# Altium schematic sheet three-phase_inverter.SchDoc: Circuito Inversor Trifásico
size A4; Engineer: Amós Nunes; Organization: occhi; SheetNumber: 4; SheetTotal: 5; Tamanho: A4; Equipament: E. T. Wheelchair
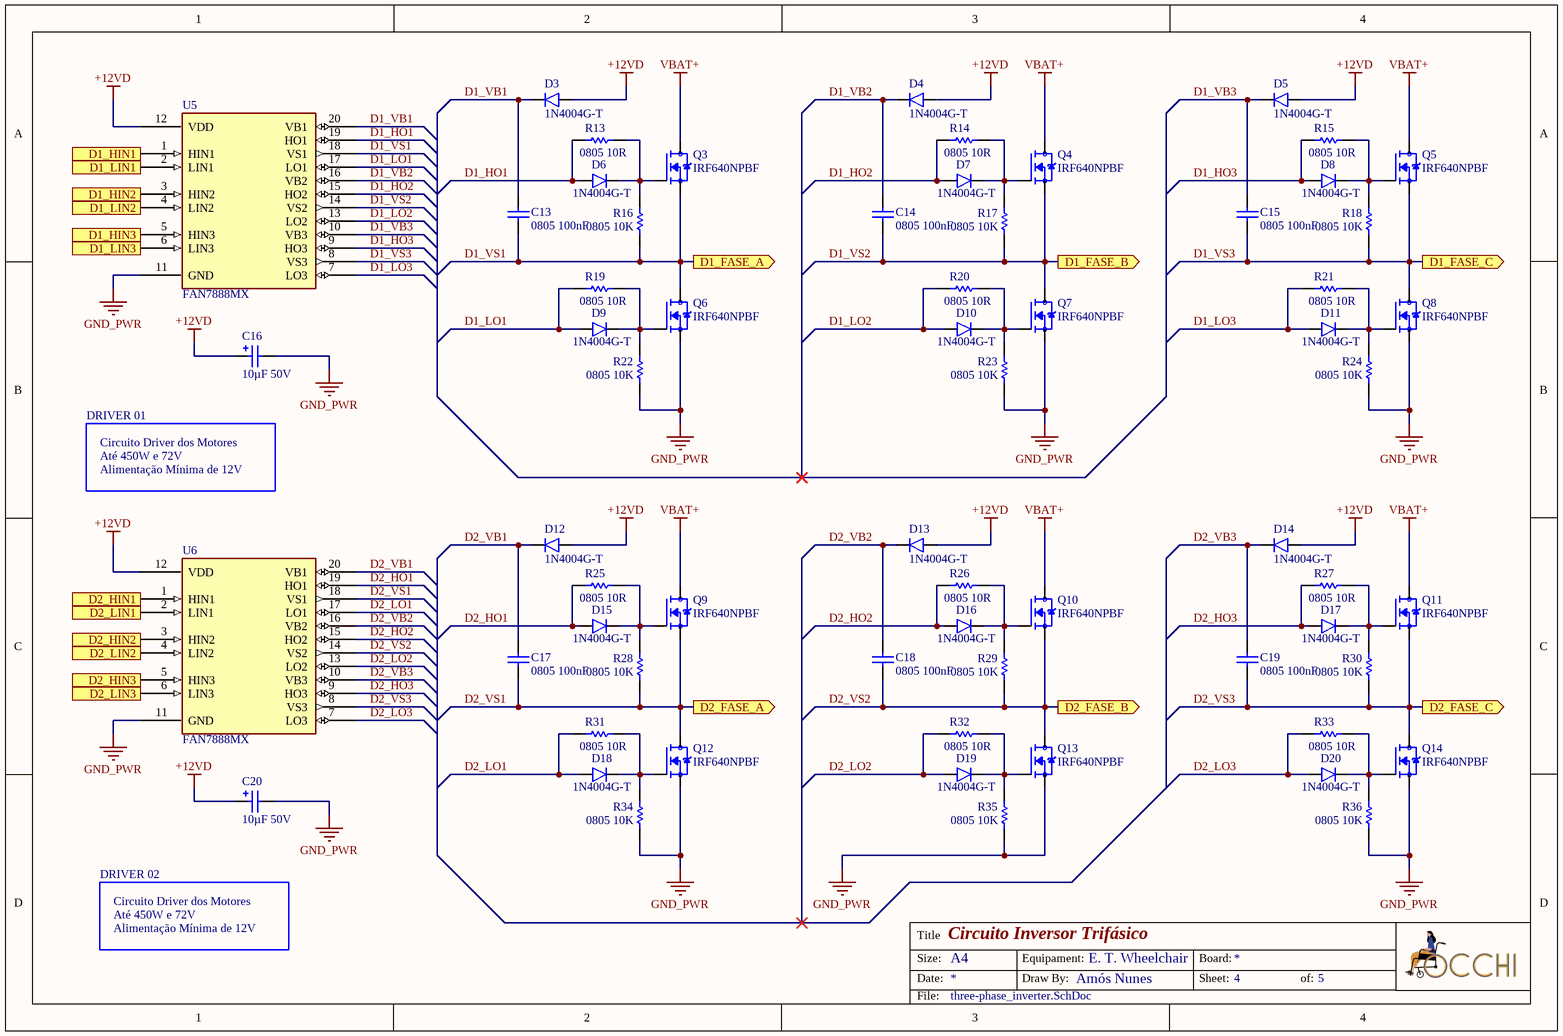
[diagram p0: three-phase_inverter.SchDoc]

## Parts
C13  0805 100nF  [CAP0805]
C14  0805 100nF  [CAP0805]
C15  0805 100nF  [CAP0805]
C16  10µF 50V  [CAP_PK/PZ_6P3X11_LOW_RUB]
C17  0805 100nF  [CAP0805]
C18  0805 100nF  [CAP0805]
C19  0805 100nF  [CAP0805]
C20  10µF 50V  [CAP_PK/PZ_6P3X11_LOW_RUB]
D3  1N4004G-T  [DO41-10]
D4  1N4004G-T  [DO41-10]
D5  1N4004G-T  [DO41-10]
D6  1N4004G-T  [DO41-10]
D7  1N4004G-T  [DO41-10]
D8  1N4004G-T  [DO41-10]
D9  1N4004G-T  [DO41-10]
D10  1N4004G-T  [DO41-10]
D11  1N4004G-T  [DO41-10]
D12  1N4004G-T  [DO41-10]
D13  1N4004G-T  [DO41-10]
D14  1N4004G-T  [DO41-10]
D15  1N4004G-T  [DO41-10]
D16  1N4004G-T  [DO41-10]
D17  1N4004G-T  [DO41-10]
D18  1N4004G-T  [DO41-10]
D19  1N4004G-T  [DO41-10]
D20  1N4004G-T  [DO41-10]
Q3  IRF640NPBF  [TO220AB_VIS]
Q4  IRF640NPBF  [TO220AB_VIS]
Q5  IRF640NPBF  [TO220AB_VIS]
Q6  IRF640NPBF  [TO220AB_VIS]
Q7  IRF640NPBF  [TO220AB_VIS]
Q8  IRF640NPBF  [TO220AB_VIS]
Q9  IRF640NPBF  [TO220AB_VIS]
Q10  IRF640NPBF  [TO220AB_VIS]
Q11  IRF640NPBF  [TO220AB_VIS]
Q12  IRF640NPBF  [TO220AB_VIS]
Q13  IRF640NPBF  [TO220AB_VIS]
Q14  IRF640NPBF  [TO220AB_VIS]
R13  0805 10R  [CAP0805]
R14  0805 10R  [CAP0805]
R15  0805 10R  [CAP0805]
R16  0805 10K  [RES0805]
R17  0805 10K  [RES0805]
R18  0805 10K  [RES0805]
R19  0805 10R  [CAP0805]
R20  0805 10R  [CAP0805]
R21  0805 10R  [CAP0805]
R22  0805 10K  [RES0805]
R23  0805 10K  [RES0805]
R24  0805 10K  [RES0805]
R25  0805 10R  [CAP0805]
R26  0805 10R  [CAP0805]
R27  0805 10R  [CAP0805]
R28  0805 10K  [RES0805]
R29  0805 10K  [RES0805]
R30  0805 10K  [RES0805]
R31  0805 10R  [CAP0805]
R32  0805 10R  [CAP0805]
R33  0805 10R  [CAP0805]
R34  0805 10K  [RES0805]
R35  0805 10K  [RES0805]
R36  0805 10K  [RES0805]
U5  FAN7888MX  [SOIC20_13X7P6_ONS]
U6  FAN7888MX  [SOIC20_13X7P6_ONS]

## Ports
D1_FASE_A (out), D1_FASE_B (out), D1_FASE_C (out), D1_HIN1 (in), D1_HIN2 (in), D1_HIN3 (in), D1_LIN1 (in), D1_LIN2 (in), D1_LIN3 (in), D2_FASE_A (out), D2_FASE_B (out), D2_FASE_C (out), D2_HIN1 (in), D2_HIN2 (in), D2_HIN3 (in), D2_LIN1 (in), D2_LIN2 (in), D2_LIN3 (in)

## Nets
+12VD: C16.1 C20.1 D3.2(A) D4.2(A) D5.2(A) D12.2(A) D13.2(A) D14.2(A) U5.12(VDD) U6.12(VDD)
GND_PWR: C16.2 C20.2 Q6.3(S) Q7.3(S) Q8.3(S) Q12.3(S) Q13.3(S) Q14.3(S) R22.2 R23.2 R24.2 R34.2 R35.2 R36.2 U5.11(GND) U6.11(GND)
VBAT+: Q3.2(D) Q4.2(D) Q5.2(D) Q9.2(D) Q10.2(D) Q11.2(D)
D1_HIN1: U5.1(HIN1) ; port D1_HIN1
D1_HIN2: U5.3(HIN2) ; port D1_HIN2
D1_HIN3: U5.5(HIN3) ; port D1_HIN3
D1_HO1: D6.2(A) R13.1 U5.19(HO1)
D1_HO2: D7.2(A) R14.1 U5.15(HO2)
D1_HO3: D8.2(A) R15.1 U5.9(HO3)
D1_LIN1: U5.2(LIN1) ; port D1_LIN1
D1_LIN2: U5.4(LIN2) ; port D1_LIN2
D1_LIN3: U5.6(LIN3) ; port D1_LIN3
D1_LO1: D9.2(A) R19.1 U5.17(LO1)
D1_LO2: D10.2(A) R20.1 U5.13(LO2)
D1_LO3: D11.2(A) R21.1 U5.7(LO3)
D1_VB1: C13.1 D3.1(K) U5.20(VB1)
D1_VB2: C14.1 D4.1(K) U5.16(VB2)
D1_VB3: C15.1 D5.1(K) U5.10(VB3)
D1_VS1: C13.2 Q3.3(S) Q6.2(D) R16.2 U5.18(VS1) ; port D1_FASE_A
D1_VS2: C14.2 Q4.3(S) Q7.2(D) R17.2 U5.14(VS2) ; port D1_FASE_B
D1_VS3: C15.2 Q5.3(S) Q8.2(D) R18.2 U5.8(VS3) ; port D1_FASE_C
D2_HIN1: U6.1(HIN1) ; port D2_HIN1
D2_HIN2: U6.3(HIN2) ; port D2_HIN2
D2_HIN3: U6.5(HIN3) ; port D2_HIN3
D2_HO1: D15.2(A) R25.1 U6.19(HO1)
D2_HO2: D16.2(A) R26.1 U6.15(HO2)
D2_HO3: D17.2(A) R27.1 U6.9(HO3)
D2_LIN1: U6.2(LIN1) ; port D2_LIN1
D2_LIN2: U6.4(LIN2) ; port D2_LIN2
D2_LIN3: U6.6(LIN3) ; port D2_LIN3
D2_LO1: D18.2(A) R31.1 U6.17(LO1)
D2_LO2: D19.2(A) R32.1 U6.13(LO2)
D2_LO3: D20.2(A) R33.1 U6.7(LO3)
D2_VB1: C17.1 D12.1(K) U6.20(VB1)
D2_VB2: C18.1 D13.1(K) U6.16(VB2)
D2_VB3: C19.1 D14.1(K) U6.10(VB3)
D2_VS1: C17.2 Q9.3(S) Q12.2(D) R28.2 U6.18(VS1) ; port D2_FASE_A
D2_VS2: C18.2 Q10.3(S) Q13.2(D) R29.2 U6.14(VS2) ; port D2_FASE_B
D2_VS3: C19.2 Q11.3(S) Q14.2(D) R30.2 U6.8(VS3) ; port D2_FASE_C
NetD6_1: D6.1(K) Q3.1(G) R13.2 R16.1
NetD7_1: D7.1(K) Q4.1(G) R14.2 R17.1
NetD8_1: D8.1(K) Q5.1(G) R15.2 R18.1
NetD9_1: D9.1(K) Q6.1(G) R19.2 R22.1
NetD10_1: D10.1(K) Q7.1(G) R20.2 R23.1
NetD11_1: D11.1(K) Q8.1(G) R21.2 R24.1
NetD15_1: D15.1(K) Q9.1(G) R25.2 R28.1
NetD16_1: D16.1(K) Q10.1(G) R26.2 R29.1
NetD17_1: D17.1(K) Q11.1(G) R27.2 R30.1
NetD18_1: D18.1(K) Q12.1(G) R31.2 R34.1
NetD19_1: D19.1(K) Q13.1(G) R32.2 R35.1
NetD20_1: D20.1(K) Q14.1(G) R33.2 R36.1

## Notes on the sheet
- DRIVER 01
- Circuito Driver dos Motores
- Até 450W e 72V
- Alimentação Mínima de 12V
- DRIVER 02
- Title
- Size:
- Date:
- Equipament:
- Draw By:
- Sheet:
- Board:
- of:
- File:

## Library data of the parts
C13-C15 C17-C19 = CC0805KRX7R9BB104: CC Series 0805 0.1 uF 50 V ±10 % Tolerance X7R SMT Multilayer Ceramic Capacitor; Manufacturer: Yageo; Tolerance: 10%; Voltage Rating: 50V; Insulation Resistance: 100GR; Supplier 1: Digi-Key; Manufacturer Part Number: CC0805KRX7R9BB104; RoHS: Yes; Category: Ceramic Capacitors; Stock 1: 7319595; Pricing 1: 4000=0,01864, 8000=0,01734 (USD); Mount: Surface Mount; Case/Package: 0805; Number of Pins: 2; Case Code (Metric): 2012; Case Code (Imperial): 0805; Material: Ceramic; Min Operating Temperature: -55°C; Max Operating Temperature: 125°C; Capacitance: 100nF; Dielectric: X7R; Packaging: Tape and Reel; Package Quantity: 1; Termination: SMD/SMT; Voltage: 50V; Series: CC; Length: 2mm; Width: 0.049inch; Height: 0.85mm; Depth: 1.25mm; Thickness: 0.033inch; Radiation Hardening: No; REACH SVHC: No SVHC; Lead Free: Lead Free; Halogen Free: Halogen Free; RoHS Compliant: Yes; ComponentLink1URL: https://datasheet.ciiva.com/11786/0900766b80d84f1d-11786009.pdf?src-supplier=RSComponents; ComponentLink1Description: https://datasheet.ciiva.com/11786/0900766b80d84f1d-11786009.pdf?src-supplier=RSComponents; ComponentLink2URL: https://datasheet.ciiva.com/155/mlccorderingcode-155929.pdf?src-supplier=Digi-Key; ComponentLink2Description: https://datasheet.ciiva.com/155/mlccorderingcode-155929.pdf?src-supplier=Digi-Key; ComponentLink3URL: https://datasheet.ciiva.com/155/mlccorderingcode-155930.pdf?src-supplier=Digi-Key; ComponentLink3Description: https://datasheet.ciiva.com/155/mlccorderingcode-155930.pdf?src-supplier=Digi-Key; ComponentLink4URL: https://datasheet.ciiva.com/155/mlccorderingcode-155931.pdf?src-supplier=Digi-Key; ComponentLink4Description: https://datasheet.ciiva.com/155/mlccorderingcode-155931.pdf?src-supplier=Digi-Key; ComponentLink5URL: https://datasheet.ciiva.com/11464/upy-gphc-x7r-6-3v-to-50v-8-11464757.pdf?src-supplier=Avnet; ComponentLink5Description: https://datasheet.ciiva.com/11464/upy-gphc-x7r-6-3v-to-50v-8-11464757.pdf?src-supplier=Avnet; ComponentLink6URL: https://datasheet.ciiva.com/16625/upy-gphc-x7r-6-3v-to-50v-8-16625549.pdf?src-supplier=Avnet+Europe; ComponentLink6Description: https://datasheet.ciiva.com/16625/upy-gphc-x7r-6-3v-to-50v-8-16625549.pdf?src-supplier=Avnet+Europe; ComponentLink7URL: https://datasheet.ciiva.com/28450/1489800-28450805.pdf?src-supplier=Element14; ComponentLink7Description: https://datasheet.ciiva.com/28450/1489800-28450805.pdf?src-supplier=Element14; ComponentLink8URL: https://datasheet.ciiva.com/46393/1734573-46393307.pdf?src-supplier=Element14; ComponentLink8Description: https://datasheet.ciiva.com/46393/1734573-46393307.pdf?src-supplier=Element14; ComponentLink9URL: https://datasheet.ciiva.com/29242/445210-da-01-en-kerko-chip-0805-x7r-0-1uf-10proz-50vg-29242074.pdf?src-supplier=Conrad; ComponentLink9Description: https://datasheet.ciiva.com/29242/445210-da-01-en-kerko-chip-0805-x7r-0-1uf-10proz-50vg-29242074.pdf?src-supplier=Conrad; Supplier Part Number 1: 311-1140-2-ND
C16 C20 = 50YXF10MEFC5X11: 10uF ±20% 50V 5000hrs@105°C AEC_D5x11mm_2mm_TM; Mfr_Name: Rubycon; Manufacturer_Part_Number: 16PK330MEFC6.3X11; Type: DEV; Capacitance: 330uF; Ripple Current: 360mA; Voltage Rating: 16V; Life (Hours): 2000Hour; Leakage Current: 3uA; Lead Diameter: 0.5mm; Dielectric Material: Aluminium; Impedance: 1.5R; Copyright: Copyright (C) 2021 Ultra Librarian. All rights reserved.; Digi-Key_Part_Number_1: 1189-1122-ND; RefDes: RefDes; Manufacturer: Rubycon; Manufacturer Part Number: 16PK330MEFC6.3X11; RoHS: Yes; Category: Aluminum Electrolytic Capacitors; Stock 1: 1848; Pricing 1: 1=0,04600, 10=0,04600, 25=0,04600, 50=0,04600, 100=0,04600, 500=0,04600 (USD); Mount: Through Hole; Case/Package: Radial; Number of Pins: 2; Min Operating Temperature: -40°C; Max Operating Temperature: 85°C; Tolerance: 20%; Termination: Radial; Ripple Current (AC): 360mA; Package Quantity: 2000; Packaging: Bulk; Voltage: 16V; Voltage Rating (DC): 16V; Series: PK; Construction: RADIAL; Diameter: 6.3mm; Height: 11mm; Lead Pitch: 2.5mm; Height - Seated (Max): 0.492inch; Radiation Hardening: No; REACH SVHC: No SVHC; RoHS Compliant: Yes; ComponentLink1URL: https://datasheet.ciiva.com/25614/0900766b810f8819-25614366.pdf?src-supplier=RSComponents; ComponentLink1Description: https://datasheet.ciiva.com/25614/0900766b810f8819-25614366.pdf?src-supplier=RSComponents; ComponentLink2URL: https://datasheet.ciiva.com/11690/e-pk-11690815.pdf?src-supplier=Avnet; ComponentLink2Description: https://datasheet.ciiva.com/11690/e-pk-11690815.pdf?src-supplier=Avnet; ComponentLink3URL: https://datasheet.ciiva.com/6328/e-pk-6328463.pdf?src-supplier=Digi-Key; ComponentLink3Description: https://datasheet.ciiva.com/6328/e-pk-6328463.pdf?src-supplier=Digi-Key; Stock 2: 46092; Pricing 2: 1=0,33800, 5=0,33800, 10=0,23000, 25=0,18400, 50=0,13800, 100=0,11600, 500=0,07900 (USD); ComponentLink4URL: https://datasheet.ciiva.com/7976/e-yxf-7976037.pdf?src-supplier=Element14; ComponentLink4Description: https://datasheet.ciiva.com/7976/e-yxf-7976037.pdf?src-supplier=Element14; ComponentLink5URL: https://datasheet.ciiva.com/6310/e-yxf-6310901.pdf?src-supplier=Digi-Key; ComponentLink5Description: https://datasheet.ciiva.com/6310/e-yxf-6310901.pdf?src-supplier=Digi-Key; Supplier 1: Newark; Supplier Part Number 1: 31M6644
D3-D20 = 1N4004G-T: Diode Standard Recovery Rectifier 400V 1A 2-Pin DO-41 T/R; Manufacturer: Diodes; Element Configuration: Single; Max Reverse Current: 5uA; Max Surge Current: 30A; Capacitance: 8pF; Forward Voltage: 1V; Recovery Time: 2us; Supplier 1: Arrow Electronics; Manufacturer Part Number: 1N4004G-T; RoHS: Yes; Category: Rectifier Diodes; Stock 1: 4700; Pricing 1: 1=0,27080, 10=0,22520, 25=0,22330, 100=0,12160, 250=0,12050, 500=0,08530, 1000=0,05810, 3000=0,05260 (USD); Mount: Through Hole; Case/Package: DO-41; Number of Pins: 2; Weight: 0.010582oz; Min Operating Temperature: -65°C; Max Operating Temperature: 175°C; Packaging: Tape and Reel; Package Quantity: 5000; Polarity: Standard; Voltage Rating (DC): 400V; Current Rating: 1A; Output Current: 1A; Max Repetitive Reverse Voltage (Vrrm): 400V; Peak Non-Repetitive Surge Current: 30A; Forward Current: 1A; Reverse Voltage (DC): 400V; Average Rectified Current: 1A; Reverse Recovery Time: 2us; Max Reverse Voltage (DC): 400V; Series: -; Length: 5.21mm; Width: 2.72mm; Height: 2.72mm; Radiation Hardening: No; Lead Free: Lead Free; RoHS Compliant: Yes; ComponentLink1URL: https://datasheet.ciiva.com/27052/1586381-27052621.pdf?src-supplier=Jameco; ComponentLink1Description: https://datasheet.ciiva.com/27052/1586381-27052621.pdf?src-supplier=Jameco; ComponentLink2URL: https://datasheet.ciiva.com/912/ds29002-912103.pdf?src-supplier=Digi-Key; ComponentLink2Description: https://datasheet.ciiva.com/912/ds29002-912103.pdf?src-supplier=Digi-Key; ComponentLink3URL: https://datasheet.ciiva.com/912/ds29002-912104.pdf?src-supplier=Digi-Key; ComponentLink3Description: https://datasheet.ciiva.com/912/ds29002-912104.pdf?src-supplier=Digi-Key; ComponentLink4URL: https://datasheet.ciiva.com/15219/getdatasheetpartid-233986-15219541.pdf?src-supplier=Verical; ComponentLink4Description: https://datasheet.ciiva.com/15219/getdatasheetpartid-233986-15219541.pdf?src-supplier=Verical; Supplier Part Number 1: 1N4004G-T
Q3-Q14 = IRF640NPBF: Mosfet, Power; N-ch; Vdss 200V; Rds(on) 0.15 Ohm; Id 18A; TO-220AB; Pd 150W; Vgs +/-20V; Manufacturer: International Rectifier; MF: Infineon; Input Capacitance: 1.16nF; Rds On Max: 150mR; Gate to Source Voltage (Vgs): 20V; Number of Elements: 1; Rise Time: 19ns; Turn-Off Delay Time: 23ns; Turn-On Delay Time: 10ns; Recovery Time: 241ns; Nominal Vgs: 4V; Fall Time: 5.5ns; Element Configuration: Single; Package: TO-220 Infineon; MP: IRF640NPBF; Price: None; Availability: Unavailable; Value: *; SnapEDA_Link: https://www.snapeda.com/parts/IRF640NPBF/Infineon%20Technologies/view-part/1737186/?ref=snap; Supplier 1: Newark; Manufacturer Part Number: IRF640NPBF; RoHS: Yes; Category: MOSFETs; Mount: Through Hole; Case/Package: TO-220AB; Number of Pins: 3; Min Operating Temperature: -55°C; Max Operating Temperature: 175°C; Max Power Dissipation: 150W; Packaging: Rail/Tube; Drain to Source Voltage (Vdss): 200V; Continuous Drain Current (ID): 18A; Power Dissipation: 150W; Package Quantity: 50; Drain to Source Breakdown Voltage: 200V; Drain to Source Resistance: 150mR; Dual Supply Voltage: 200V; Termination: Through Hole; Voltage Rating (DC): 200V; Current Rating: 18A; On-State Resistance: 150mR; Series: HEXFET®; Drain-source On Resistance-Max: 150mR; Length: 10.67mm; Width: 4.83mm; Height: 8.77mm; Radiation Hardening: No; RoHS Compliant: Yes; REACH SVHC: No SVHC; Lead Free: Lead Free; ComponentLink1URL: https://datasheet.ciiva.com/6377/irf640npbf-6377424.pdf?src-supplier=Digi-Key; ComponentLink1Description: https://datasheet.ciiva.com/6377/irf640npbf-6377424.pdf?src-supplier=Digi-Key; ComponentLink2URL: https://datasheet.ciiva.com/19459/1560288-19459517.pdf?src-supplier=Jameco; ComponentLink2Description: https://datasheet.ciiva.com/19459/1560288-19459517.pdf?src-supplier=Jameco; ComponentLink3URL: https://datasheet.ciiva.com/7798/irf640npbf-7798652.pdf?src-supplier=Element14; ComponentLink3Description: https://datasheet.ciiva.com/7798/irf640npbf-7798652.pdf?src-supplier=Element14; ComponentLink4URL: https://datasheet.ciiva.com/16449/irf640n-16449351.pdf?src-supplier=Future+Electronics; ComponentLink4Description: https://datasheet.ciiva.com/16449/irf640n-16449351.pdf?src-supplier=Future+Electronics; ComponentLink5URL: https://datasheet.ciiva.com/7253/irf640npbf-7253768.pdf?src-supplier=Newark; ComponentLink5Description: https://datasheet.ciiva.com/7253/irf640npbf-7253768.pdf?src-supplier=Newark; Supplier Part Number 1: 63J7351
R13-R15 R19-R21 R25-R27 R31-R33 = RC0805FR-0710RL: 10R Ohms ± 1.00% 0.125W ± 200ppm/℃ 0805; Manufacturer: Yageo; Power Rating: 125mW; Tolerance: 1%; Voltage Rating: 150V; Temperature Coefficient: 200ppm/°C; Supplier 1: RSComponents; Manufacturer Part Number: RC0805FR-0710RL; RoHS: Yes; Category: Chip SMD Resistors; Stock 1: 170000; Pricing 1: 5000=0,01300 (USD); Case/Package: 0805; Number of Pins: 2; Case Code (Imperial): 0805; Case Code (Metric): 2012; Size Code: 0805; Min Operating Temperature: -55°C; Max Operating Temperature: 155°C; Resistance: 10R; Packaging: Tape and Reel; Voltage Rating (DC): 150V; Package Quantity: 1; Termination: SMD/SMT; Resistor Type: Thick Film; Number of Terminations: 2; Max Power Dissipation: 125mW; Features: Moisture Resistant; Series: RC; Resistance Tolerance: 1%; Construction: Rectangular; Technology: THICK FILM; Length: 2mm; Width: 1.25mm; Height: 0.5mm; Depth: 1.25mm; RoHS Compliant: Yes; REACH SVHC: No SVHC; Lead Free: Lead Free; ComponentLink1URL: https://datasheet.ciiva.com/11809/0900766b8106beab-11809370.pdf?src-supplier=RSComponents; ComponentLink1Description: https://datasheet.ciiva.com/11809/0900766b8106beab-11809370.pdf?src-supplier=RSComponents; ComponentLink2URL: https://datasheet.ciiva.com/46412/444164-46412859.pdf?src-supplier=Element14; ComponentLink2Description: https://datasheet.ciiva.com/46412/444164-46412859.pdf?src-supplier=Element14; ComponentLink3URL: https://datasheet.ciiva.com/46447/444164-46447565.pdf?src-supplier=Element14; ComponentLink3Description: https://datasheet.ciiva.com/46447/444164-46447565.pdf?src-supplier=Element14; ComponentLink4URL: https://datasheet.ciiva.com/2457/pyu-r-int-thick-7-2457099.pdf?src-supplier=Digi-Key; ComponentLink4Description: https://datasheet.ciiva.com/2457/pyu-r-int-thick-7-2457099.pdf?src-supplier=Digi-Key; ComponentLink5URL: https://datasheet.ciiva.com/2457/pyu-r-int-thick-7-2457100.pdf?src-supplier=Digi-Key; ComponentLink5Description: https://datasheet.ciiva.com/2457/pyu-r-int-thick-7-2457100.pdf?src-supplier=Digi-Key; ComponentLink6URL: https://datasheet.ciiva.com/2457/pyu-r-int-thick-7-2457098.pdf?src-supplier=Digi-Key; ComponentLink6Description: https://datasheet.ciiva.com/2457/pyu-r-int-thick-7-2457098.pdf?src-supplier=Digi-Key; ComponentLink7URL: https://datasheet.ciiva.com/12555/rc0805-257173-12555112.pdf?src-supplier=Mouser; ComponentLink7Description: https://datasheet.ciiva.com/12555/rc0805-257173-12555112.pdf?src-supplier=Mouser; ComponentLink8URL: https://datasheet.ciiva.com/7941/444164-7941688.pdf?src-supplier=Element14; ComponentLink8Description: https://datasheet.ciiva.com/7941/444164-7941688.pdf?src-supplier=Element14; ComponentLink9URL: https://datasheet.ciiva.com/7941/444164-7941687.pdf?src-supplier=Element14; ComponentLink9Description: https://datasheet.ciiva.com/7941/444164-7941687.pdf?src-supplier=Element14; Supplier Part Number 1: 6185179
R16-R18 R22-R24 R28-R30 R34-R36 = RC0805FR-0710KL: 10K Omhs 0805 ± 1.00% 0.125W ± 100ppm/℃; Manufacturer: Yageo; Manufacturer Part Number: RC0603FR-0710KL; Tolerance: 1%; Resistance: 10kR; Temperature Coefficient: 100ppm/°C; Voltage Rating: 75V; Voltage Rating (DC): 50V; Power Rating: 100mW; RoHS: Yes; Category: Chip SMD Resistors; Stock 1: 19091268; Pricing 1: 5000=0,00312 (USD); Case/Package: 0603; Number of Pins: 2; Case Code (Imperial): 0603; Case Code (Metric): 1608; Weight: 7.1E-05oz; Size Code: 0603; Min Operating Temperature: -55°C; Max Operating Temperature: 155°C; Resistor Type: Thick Film; Packaging: Tape and Reel; Termination: SMD/SMT; Features: Moisture Resistant; Series: RC; Max Power Dissipation: 100mW; Number of Terminations: 2; Resistance Tolerance: 1%; Construction: Rectangular; Length: 1.6mm; Width: 0.8mm; Height: 0.45mm; Depth: 0.8mm; Lead Pitch: 0.3mm; RoHS Compliant: Yes; REACH SVHC: Unknown; Military Standard: Not; Lead Free: Lead Free; ComponentLink1URL: https://datasheet.ciiva.com/7660/38590-7660789.pdf?src-supplier=Element14; ComponentLink1Description: https://datasheet.ciiva.com/7660/38590-7660789.pdf?src-supplier=Element14; ComponentLink2URL: https://datasheet.ciiva.com/7983/443971-7983596.pdf?src-supplier=Element14; ComponentLink2Description: https://datasheet.ciiva.com/7983/443971-7983596.pdf?src-supplier=Element14; ComponentLink3URL: https://datasheet.ciiva.com/22747/443971-22747519.pdf?src-supplier=Element14; ComponentLink3Description: https://datasheet.ciiva.com/22747/443971-22747519.pdf?src-supplier=Element14; ComponentLink4URL: https://datasheet.ciiva.com/46440/1868787-46440891.pdf?src-supplier=Element14; ComponentLink4Description: https://datasheet.ciiva.com/46440/1868787-46440891.pdf?src-supplier=Element14; ComponentLink5URL: https://datasheet.ciiva.com/7746/1738695-7746239.pdf?src-supplier=Element14; ComponentLink5Description: https://datasheet.ciiva.com/7746/1738695-7746239.pdf?src-supplier=Element14; ComponentLink6URL: https://datasheet.ciiva.com/15189/getdatasheetpartid-409289-15189591.pdf?src-supplier=Verical; ComponentLink6Description: https://datasheet.ciiva.com/15189/getdatasheetpartid-409289-15189591.pdf?src-supplier=Verical; Stock 2: 435000; Pricing 2: 5000=0,00700 (USD); Package Quantity: 1; Technology: THICK FILM; ComponentLink7URL: https://datasheet.ciiva.com/11808/0900766b8106beab-11808151.pdf?src-supplier=RSComponents; ComponentLink7Description: https://datasheet.ciiva.com/11808/0900766b8106beab-11808151.pdf?src-supplier=RSComponents; ComponentLink8URL: https://datasheet.ciiva.com/46447/444164-46447563.pdf?src-supplier=Element14; ComponentLink8Description: https://datasheet.ciiva.com/46447/444164-46447563.pdf?src-supplier=Element14; ComponentLink9URL: https://datasheet.ciiva.com/2456/pyu-r-int-thick-7-2456973.pdf?src-supplier=Digi-Key; ComponentLink9Description: https://datasheet.ciiva.com/2456/pyu-r-int-thick-7-2456973.pdf?src-supplier=Digi-Key; ComponentLink10URL: https://datasheet.ciiva.com/2456/pyu-r-int-thick-7-2456974.pdf?src-supplier=Digi-Key; ComponentLink10Description: https://datasheet.ciiva.com/2456/pyu-r-int-thick-7-2456974.pdf?src-supplier=Digi-Key; ComponentLink11URL: https://datasheet.ciiva.com/2456/pyu-r-int-thick-7-2456972.pdf?src-supplier=Digi-Key; ComponentLink11Description: https://datasheet.ciiva.com/2456/pyu-r-int-thick-7-2456972.pdf?src-supplier=Digi-Key; ComponentLink12URL: https://datasheet.ciiva.com/12669/rc0805-12669688.pdf?src-supplier=Mouser; ComponentLink12Description: https://datasheet.ciiva.com/12669/rc0805-12669688.pdf?src-supplier=Mouser; ComponentLink13URL: https://datasheet.ciiva.com/16747/rc0805-16747087.pdf?src-supplier=Future+Electronics; ComponentLink13Description: https://datasheet.ciiva.com/16747/rc0805-16747087.pdf?src-supplier=Future+Electronics; Supplier 1: RSComponents; Supplier Part Number 1: 6185163
U5 U6 = FAN7888MX: Driver 200V 0.65A 6-OUT Hi/Lo Side Half Brdg Non-Inv 20-Pin SOIC W T/R; Mfr_Name: onsemi; Manufacturer: ON Semiconductor / Fairchild; Number of Outputs: 6; Max Supply Voltage: 225V; Min Supply Voltage: 10V; Max Output Current: 650mA; Max Power Dissipation: 1.47W; Rise Time: 50ns; Propagation Delay: 440ns; Nominal Supply Current: 350uA; Number of Drivers: 3; Fall Time: 30ns; Turn-On Delay Time: 220ns; Turn-Off Delay Time: 240ns; Power Dissipation: 1.8W; Operating Supply Voltage: 15V; Copyright: Copyright (C) 2022 Ultra Librarian. All rights reserved.; Manufacturer_Part_Number: FAN7888MX; Digi-Key_Part_Number_1: FAN7888MXTR-ND; Digi-Key_Part_Number_2: FAN7888MXCT-ND; Digi-Key_Part_Number_3: FAN7888MXDKR-ND; Digi-Key_Part_Number_4: 2156-FAN7888MX-OS-ND; RefDes: RefDes; Type: DEV; Supplier 1: Newark; Manufacturer Part Number: FAN7888MX; RoHS: Yes; Category: Gate Drivers; Pricing 1: 1=1,65000, 1000=1,65000, 3000=1,58000, 8000=1,48000 (USD); Mount: Surface Mount; Case/Package: SOIC; Number of Pins: 20; Weight: 0.801g; Min Operating Temperature: -40°C; Max Operating Temperature: 125°C; Packaging: Tape and Reel; Package Quantity: 1; Output Current: 650mA; Series: -; Supply Current: 350uA; Length: 12.8mm; Width: 7.5mm; Height: 2.45mm; Radiation Hardening: No; REACH SVHC: No SVHC; Lead Free: Lead Free; RoHS Compliant: Yes; ComponentLink1URL: https://datasheet.ciiva.com/3148/fan7888-3148896.pdf?src-supplier=Avnet; ComponentLink1Description: https://datasheet.ciiva.com/3148/fan7888-3148896.pdf?src-supplier=Avnet; ComponentLink2URL: https://datasheet.ciiva.com/4898/fan7888-77105-4898519.pdf?src-supplier=Mouser; ComponentLink2Description: https://datasheet.ciiva.com/4898/fan7888-77105-4898519.pdf?src-supplier=Mouser; ComponentLink3URL: https://datasheet.ciiva.com/23749/1729223-23749606.pdf?src-supplier=Newark; ComponentLink3Description: https://datasheet.ciiva.com/23749/1729223-23749606.pdf?src-supplier=Newark; ComponentLink4URL: https://datasheet.ciiva.com/1949/fan7888-1949745.pdf?src-supplier=Digi-Key; ComponentLink4Description: https://datasheet.ciiva.com/1949/fan7888-1949745.pdf?src-supplier=Digi-Key; ComponentLink5URL: https://datasheet.ciiva.com/1949/fan7888-1949746.pdf?src-supplier=Digi-Key; ComponentLink5Description: https://datasheet.ciiva.com/1949/fan7888-1949746.pdf?src-supplier=Digi-Key; ComponentLink6URL: https://datasheet.ciiva.com/1949/fan7888-1949747.pdf?src-supplier=Digi-Key; ComponentLink6Description: https://datasheet.ciiva.com/1949/fan7888-1949747.pdf?src-supplier=Digi-Key; ComponentLink7URL: https://datasheet.ciiva.com/1499/1729223-1499307.pdf?src-supplier=Element14; ComponentLink7Description: https://datasheet.ciiva.com/1499/1729223-1499307.pdf?src-supplier=Element14; Supplier Part Number 1: 07P9154